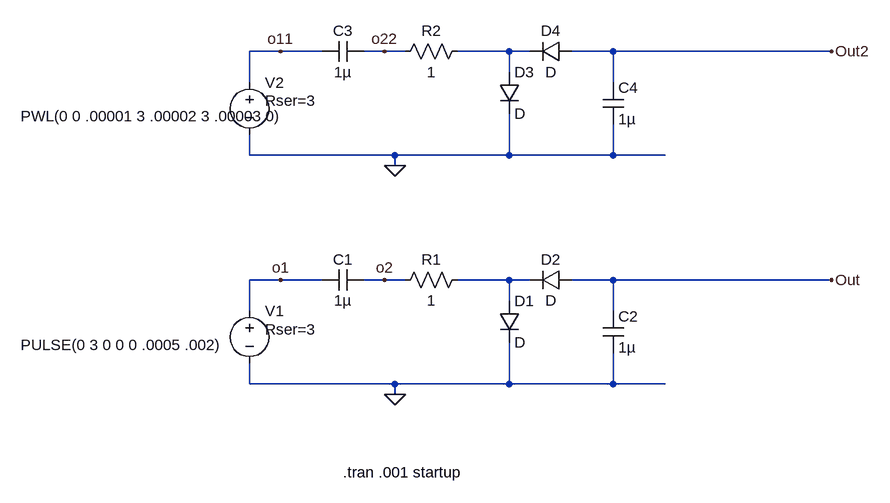
[diagram p0: schematic positiveToNegative2.asc]
positiveToNegative2.asc, the LTspice schematic file:
Version 4
SHEET 1 880 680
WIRE -96 -304 -144 -304
WIRE -32 -304 -96 -304
WIRE 64 -304 32 -304
WIRE 96 -304 64 -304
WIRE 256 -304 176 -304
WIRE 288 -304 256 -304
WIRE 416 -304 352 -304
WIRE 752 -304 416 -304
WIRE 256 -272 256 -304
WIRE -144 -256 -144 -304
WIRE 416 -256 416 -304
WIRE -144 -144 -144 -176
WIRE 80 -144 -144 -144
WIRE 256 -144 256 -208
WIRE 256 -144 80 -144
WIRE 416 -144 416 -192
WIRE 416 -144 256 -144
WIRE 496 -144 416 -144
WIRE 80 -128 80 -144
WIRE -96 48 -144 48
WIRE -32 48 -96 48
WIRE 64 48 32 48
WIRE 96 48 64 48
WIRE 256 48 176 48
WIRE 288 48 256 48
WIRE 416 48 352 48
WIRE 752 48 416 48
WIRE 256 80 256 48
WIRE -144 96 -144 48
WIRE 416 96 416 48
WIRE -144 208 -144 176
WIRE 80 208 -144 208
WIRE 256 208 256 144
WIRE 256 208 80 208
WIRE 416 208 416 160
WIRE 416 208 256 208
WIRE 496 208 416 208
WIRE 80 224 80 208
FLAG 80 224 0
FLAG 752 48 Out
FLAG -96 48 o1
FLAG 64 48 o2
FLAG 80 -128 0
FLAG 752 -304 Out2
FLAG -96 -304 o11
FLAG 64 -304 o22
SYMBOL voltage -144 80 R0
WINDOW 123 0 0 Left 0
WINDOW 39 24 44 Left 2
WINDOW 3 -352 68 Left 2
SYMATTR SpiceLine Rser=3
SYMATTR Value PULSE(0 3 0 0 0 .0005 .002)
SYMATTR InstName V1
SYMBOL cap 32 32 R90
WINDOW 0 0 32 VBottom 2
WINDOW 3 32 32 VTop 2
SYMATTR InstName C1
SYMATTR Value 1µ
SYMBOL res 192 32 R90
WINDOW 0 0 56 VBottom 2
WINDOW 3 32 56 VTop 2
SYMATTR InstName R1
SYMATTR Value 1
SYMBOL diode 240 80 R0
SYMATTR InstName D1
SYMBOL diode 352 32 R90
WINDOW 0 0 32 VBottom 2
WINDOW 3 32 32 VTop 2
SYMATTR InstName D2
SYMBOL cap 400 96 R0
SYMATTR InstName C2
SYMATTR Value 1µ
SYMBOL voltage -144 -272 R0
WINDOW 123 0 0 Left 0
WINDOW 39 24 44 Left 2
WINDOW 3 -352 68 Left 2
SYMATTR SpiceLine Rser=3
SYMATTR Value PWL(0 0 .00001 3 .00002 3 .00003 0)
SYMATTR InstName V2
SYMBOL cap 32 -320 R90
WINDOW 0 0 32 VBottom 2
WINDOW 3 32 32 VTop 2
SYMATTR InstName C3
SYMATTR Value 1µ
SYMBOL res 192 -320 R90
WINDOW 0 0 56 VBottom 2
WINDOW 3 32 56 VTop 2
SYMATTR InstName R2
SYMATTR Value 1
SYMBOL diode 240 -272 R0
SYMATTR InstName D3
SYMBOL diode 352 -320 R90
WINDOW 0 0 32 VBottom 2
WINDOW 3 32 32 VTop 2
SYMATTR InstName D4
SYMBOL cap 400 -256 R0
SYMATTR InstName C4
SYMATTR Value 1µ
TEXT 0 344 Left 2 !.tran .001 startup

The netlist it stands for:
* positiveToNegative2.asc
V1 o1 0 PULSE(0 3 0 0 0 .0005 .002) Rser=3
C1 o2 o1 1µ
R1 N002 o2 1
D1 N002 0 D
D2 Out N002 D
C2 Out 0 1µ
V2 o11 0 PWL(0 0 .00001 3 .00002 3 .00003 0) Rser=3
C3 o22 o11 1µ
R2 N001 o22 1
D3 N001 0 D
D4 Out2 N001 D
C4 Out2 0 1µ
.model D D
.lib standard.dio
.tran .001 startup
.backanno
.end